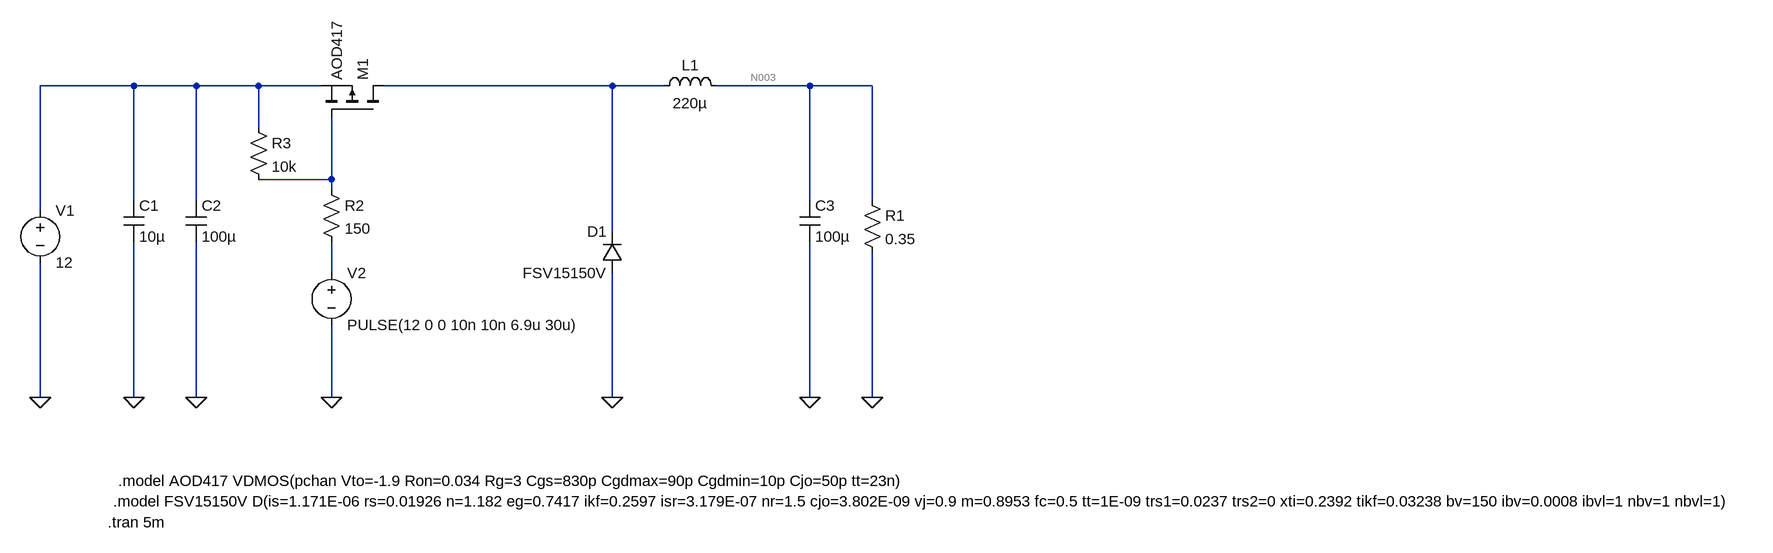
[diagram p0: schematic peltier.asc]
peltier.asc, the LTspice schematic file:
Version 4
SHEET 1 2284 680
WIRE -496 -304 -640 -304
WIRE -400 -304 -496 -304
WIRE -304 -304 -400 -304
WIRE -208 -304 -304 -304
WIRE 240 -304 -112 -304
WIRE 320 -304 240 -304
WIRE 544 -304 400 -304
WIRE 640 -304 544 -304
WIRE -304 -240 -304 -304
WIRE -192 -160 -192 -256
WIRE -192 -160 -304 -160
WIRE -192 -144 -192 -160
WIRE -496 -128 -496 -304
WIRE -400 -128 -400 -304
WIRE 544 -128 544 -304
WIRE 640 -128 640 -304
WIRE -640 -112 -640 -304
WIRE 240 -80 240 -304
WIRE -192 -16 -192 -64
WIRE -640 176 -640 -32
WIRE -496 176 -496 -64
WIRE -400 176 -400 -64
WIRE -192 176 -192 64
WIRE 240 176 240 -16
WIRE 544 176 544 -64
WIRE 640 176 640 -48
FLAG -192 176 0
FLAG -640 176 0
FLAG -496 176 0
FLAG -400 176 0
FLAG 640 176 0
FLAG 544 176 0
FLAG 240 176 0
SYMBOL voltage -640 -128 R0
WINDOW 123 0 0 Left 0
WINDOW 39 0 0 Left 0
SYMATTR InstName V1
SYMATTR Value 12
SYMBOL cap -512 -128 R0
SYMATTR InstName C1
SYMATTR Value 10µ
SYMBOL cap -416 -128 R0
SYMATTR InstName C2
SYMATTR Value 100µ
SYMBOL pmos -112 -256 M270
SYMATTR InstName M1
SYMATTR Value AOD417
SYMBOL voltage -192 -32 R0
WINDOW 123 0 0 Left 0
WINDOW 39 0 0 Left 0
SYMATTR InstName V2
SYMATTR Value PULSE(12 0 0 10n 10n 6.9u 30u)
SYMBOL ind 304 -288 R270
WINDOW 0 32 56 VTop 2
WINDOW 3 5 56 VBottom 2
SYMATTR InstName L1
SYMATTR Value 220µ
SYMBOL res 624 -144 R0
SYMATTR InstName R1
SYMATTR Value 0.35
SYMBOL cap 528 -128 R0
SYMATTR InstName C3
SYMATTR Value 100µ
SYMBOL res -208 -160 R0
SYMATTR InstName R2
SYMATTR Value 150
SYMBOL res -320 -256 R0
SYMATTR InstName R3
SYMATTR Value 10k
SYMBOL diode 256 -16 R180
WINDOW 0 24 64 Left 2
WINDOW 3 24 0 Left 2
SYMATTR InstName D1
SYMATTR Value FSV15150V
TEXT -520 304 Left 2 !.model AOD417 VDMOS(pchan Vto=-1.9 Ron=0.034 Rg=3 Cgs=830p Cgdmax=90p Cgdmin=10p Cjo=50p tt=23n)
TEXT -528 336 Left 2 !.model FSV15150V D(is=1.171E-06 rs=0.01926 n=1.182 eg=0.7417 ikf=0.2597 isr=3.179E-07 nr=1.5 cjo=3.802E-09 vj=0.9 m=0.8953 fc=0.5 tt=1E-09 trs1=0.0237 trs2=0 xti=0.2392 tikf=0.03238 bv=150 ibv=0.0008 ibvl=1 nbv=1 nbvl=1)
TEXT -536 368 Left 2 !.tran 5m

The netlist it stands for:
* peltier.asc
V1 N001 0 12
C1 N001 0 10µ
C2 N001 0 100µ
M1 N002 N004 N001 N001 AOD417
V2 N005 0 PULSE(12 0 0 10n 10n 6.9u 30u)
L1 N002 N003 220µ
R1 N003 0 0.35
C3 N003 0 100µ
R2 N004 N005 150
R3 N001 N004 10k
D1 0 N002 FSV15150V
.model D D
.lib standard.dio
.model NMOS NMOS
.model PMOS PMOS
.lib standard.mos
.model AOD417 VDMOS(pchan Vto=-1.9 Ron=0.034 Rg=3 Cgs=830p Cgdmax=90p Cgdmin=10p Cjo=50p tt=23n)
.model FSV15150V D(is=1.171E-06 rs=0.01926 n=1.182 eg=0.7417 ikf=0.2597 isr=3.179E-07 nr=1.5 cjo=3.802E-09 vj=0.9 m=0.8953 fc=0.5 tt=1E-09 trs1=0.0237 trs2=0 xti=0.2392 tikf=0.03238 bv=150 ibv=0.0008 ibvl=1 nbv=1 nbvl=1)
.tran 5m
.backanno
.end

* Results of the author's LTspice run, read from the files saved beside the schematic
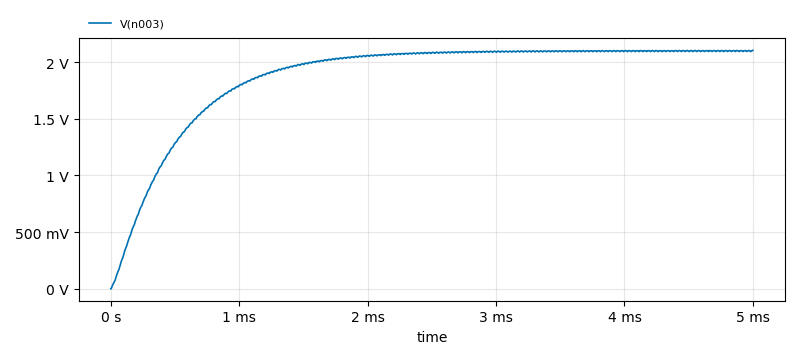
[diagram p1: Transient Analysis of peltier.asc, plotted from the saved traces]
* Transient Analysis, 1 run:
*   V(n003): min 0 V, max 2.103 V, average 1.877 V, rms 1.927 V, last 2.103 V